# Altium schematic sheet LPDDR4 SDRAM - 2.SchDoc: RK3399 SOM Module
size A3; Date: 23.05.2023; Author: Łukasz Nowarkiewicz; SheetNumber: 2; SheetTotal: 21; RegistrationBookNumber: 144201; title_sheet: LPDDR4 SDRAM - 2
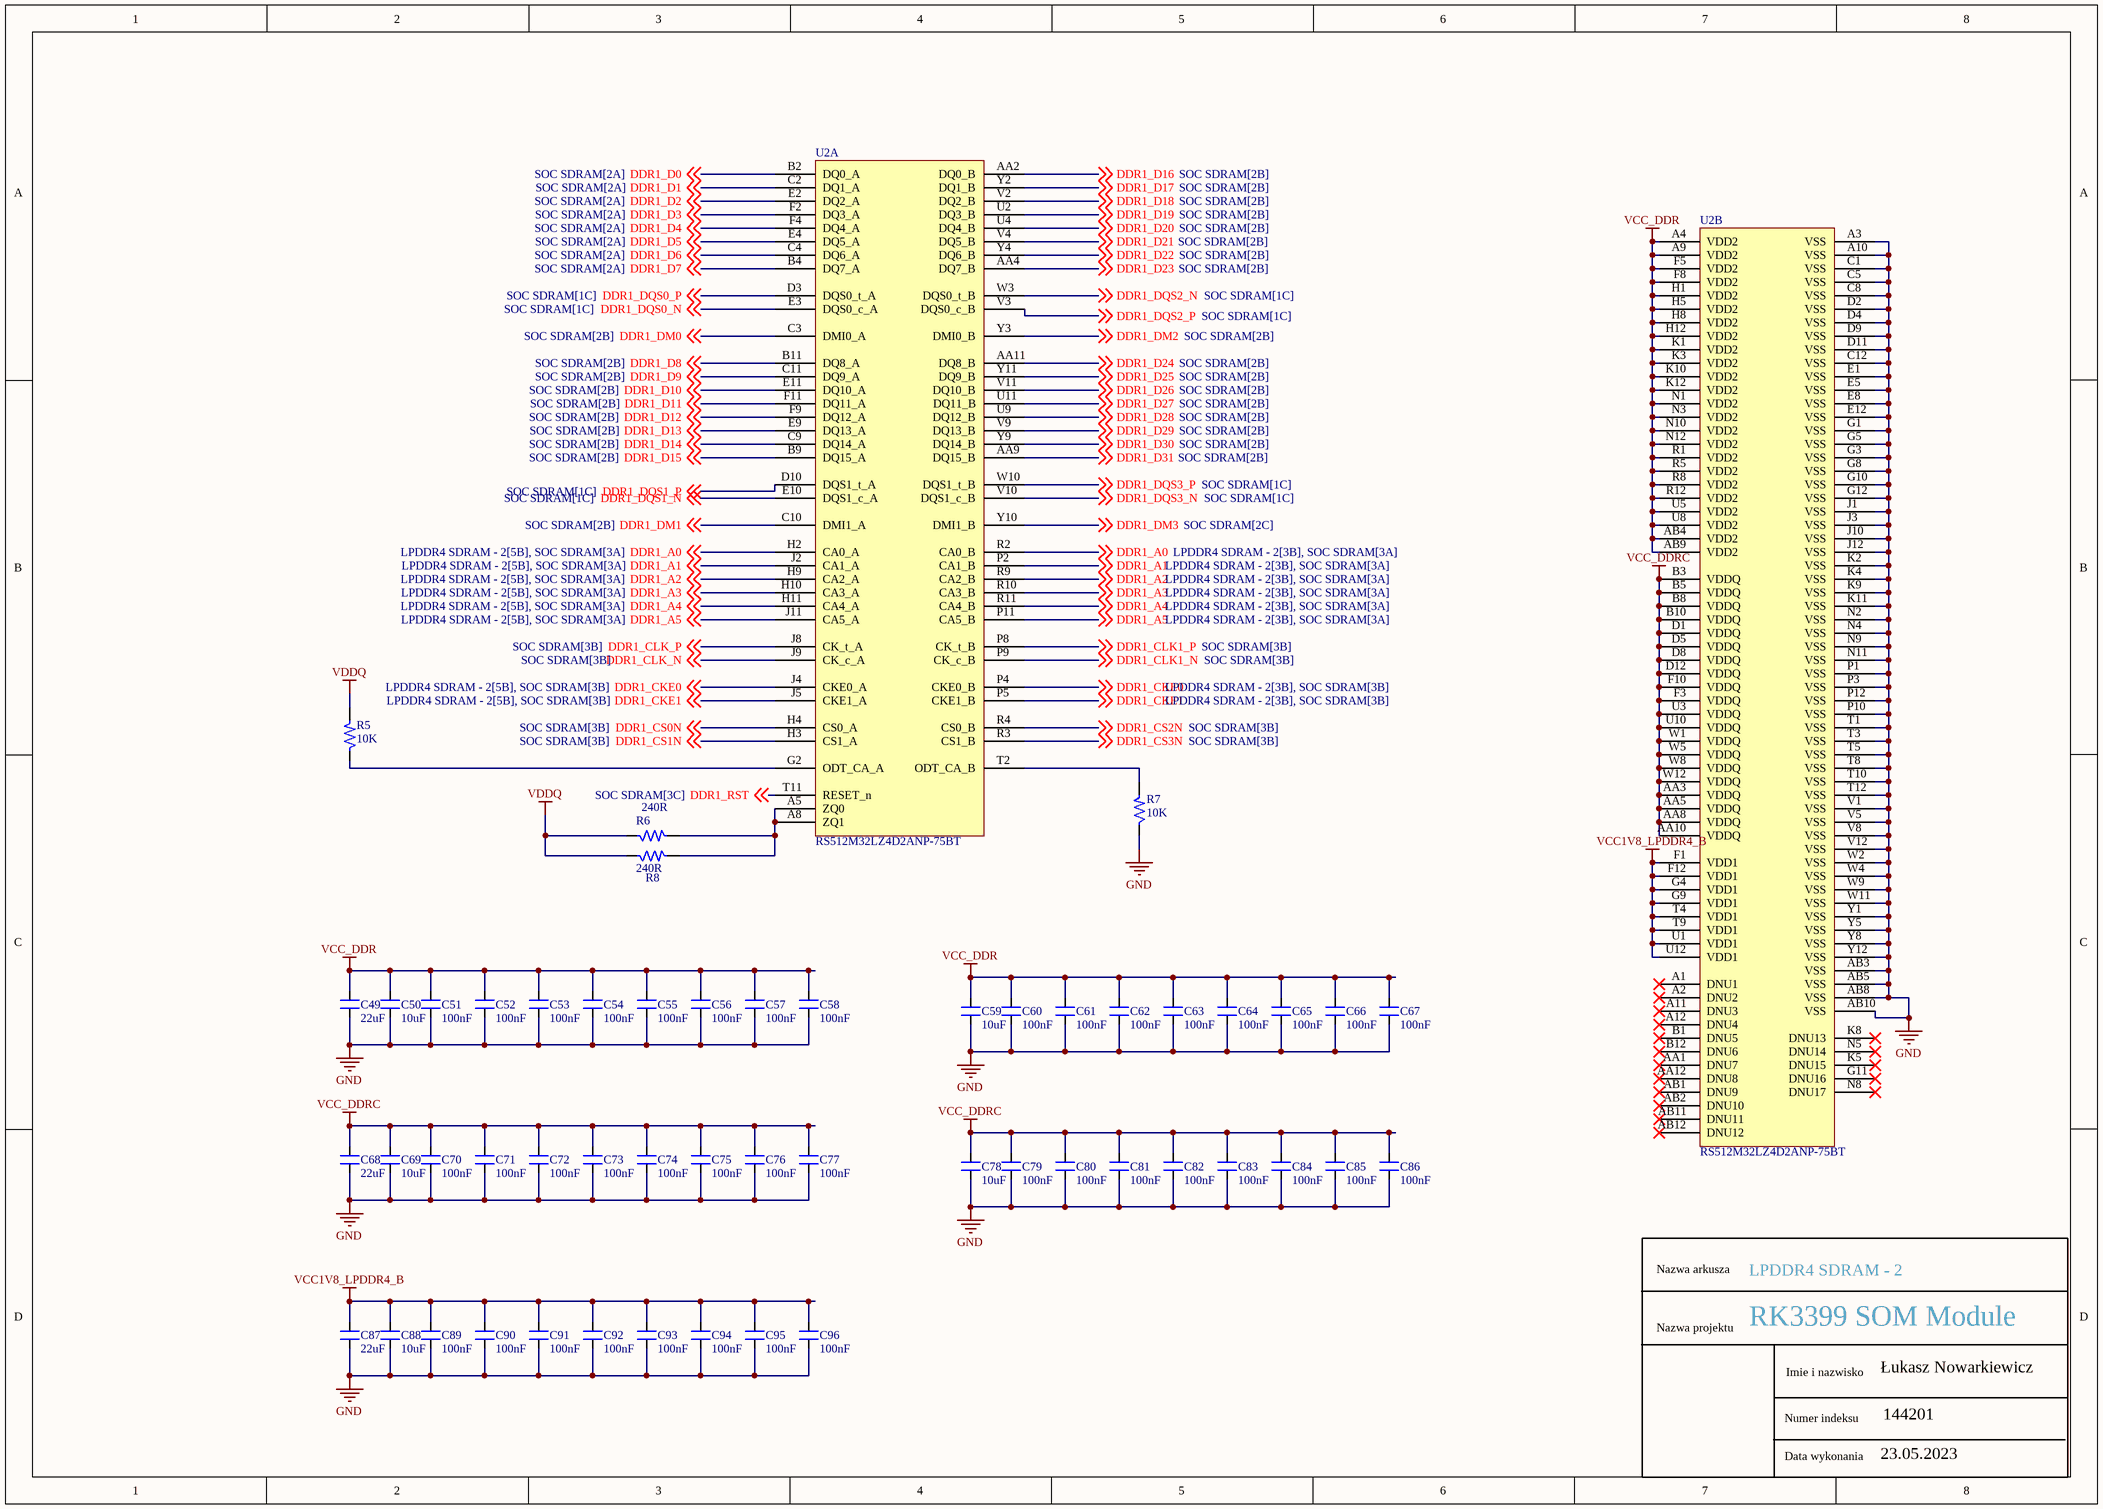
[diagram p0: LPDDR4 SDRAM - 2.SchDoc]

## Parts
C49  22uF  [CAP_0603]
C50  10uF  [CAP_0603]
C51  100nF  [CAP_0402]
C52  100nF  [CAP_0402]
C53  100nF  [CAP_0402]
C54  100nF  [CAP_0402]
C55  100nF  [CAP_0402]
C56  100nF  [CAP_0402]
C57  100nF  [CAP_0402]
C58  100nF  [CAP_0402]
C59  10uF  [CAP_0603]
C60  100nF  [CAP_0402]
C61  100nF  [CAP_0402]
C62  100nF  [CAP_0402]
C63  100nF  [CAP_0402]
C64  100nF  [CAP_0402]
C65  100nF  [CAP_0402]
C66  100nF  [CAP_0402]
C67  100nF  [CAP_0402]
C68  22uF  [CAP_0603]
C69  10uF  [CAP_0603]
C70  100nF  [CAP_0402]
C71  100nF  [CAP_0402]
C72  100nF  [CAP_0402]
C73  100nF  [CAP_0402]
C74  100nF  [CAP_0402]
C75  100nF  [CAP_0402]
C76  100nF  [CAP_0402]
C77  100nF  [CAP_0402]
C78  10uF  [CAP_0603]
C79  100nF  [CAP_0402]
C80  100nF  [CAP_0402]
C81  100nF  [CAP_0402]
C82  100nF  [CAP_0402]
C83  100nF  [CAP_0402]
C84  100nF  [CAP_0402]
C85  100nF  [CAP_0402]
C86  100nF  [CAP_0402]
C87  22uF  [CAP_0603]
C88  10uF  [CAP_0603]
C89  100nF  [CAP_0402]
C90  100nF  [CAP_0402]
C91  100nF  [CAP_0402]
C92  100nF  [CAP_0402]
C93  100nF  [CAP_0402]
C94  100nF  [CAP_0402]
C95  100nF  [CAP_0402]
C96  100nF  [CAP_0402]
R5  10K  [RES_0201]
R6  240R  [RES_0201]
R7  10K  [RES_0201]
R8  240R  [RES_0201]
U2  RS512M32LZ4D2ANP-75BT  [FBGA200_SMD]  (parts A,B of 2)

## Nets
GND: C49.1 C50.1 C51.1 C52.1 C53.1 C54.1 C55.1 C56.1 C57.1 C58.1 C59.1 C60.1 C61.1 C62.1 C63.1 C64.1 C65.1 C66.1 C67.1 C68.1 C69.1 C70.1 C71.1 C72.1 C73.1 C74.1 C75.1 C76.1 C77.1 C78.1 C79.1 C80.1 C81.1 C82.1 C83.1 C84.1 C85.1 C86.1 C87.1 C88.1 C89.1 C90.1 C91.1 C92.1 C93.1 C94.1 C95.1 C96.1 R7.1 U2.A3(VSS) U2.A10(VSS) U2.AB3(VSS) U2.AB5(VSS) U2.AB8(VSS) U2.AB10(VSS) U2.C1(VSS) U2.C5(VSS) U2.C8(VSS) U2.C12(VSS) U2.D2(VSS) U2.D4(VSS) U2.D9(VSS) U2.D11(VSS) U2.E1(VSS) U2.E5(VSS) U2.E8(VSS) U2.E12(VSS) U2.G1(VSS) U2.G3(VSS) U2.G5(VSS) U2.G8(VSS) U2.G10(VSS) U2.G12(VSS) U2.J1(VSS) U2.J3(VSS) U2.J10(VSS) U2.J12(VSS) U2.K2(VSS) U2.K4(VSS) U2.K9(VSS) U2.K11(VSS) U2.N2(VSS) U2.N4(VSS) U2.N9(VSS) U2.N11(VSS) U2.P1(VSS) U2.P3(VSS) U2.P10(VSS) U2.P12(VSS) U2.T1(VSS) U2.T3(VSS) U2.T5(VSS) U2.T8(VSS) U2.T10(VSS) U2.T12(VSS) U2.V1(VSS) U2.V5(VSS) U2.V8(VSS) U2.V12(VSS) U2.W2(VSS) U2.W4(VSS) U2.W9(VSS) U2.W11(VSS) U2.Y1(VSS) U2.Y5(VSS) U2.Y8(VSS) U2.Y12(VSS)
VCC1V8_LPDDR4_B: C87.2 C88.2 C89.2 C90.2 C91.2 C92.2 C93.2 C94.2 C95.2 C96.2 U2.F1(VDD1) U2.F12(VDD1) U2.G4(VDD1) U2.G9(VDD1) U2.T4(VDD1) U2.T9(VDD1) U2.U1(VDD1) U2.U12(VDD1)
VCC_DDR: C49.2 C50.2 C51.2 C52.2 C53.2 C54.2 C55.2 C56.2 C57.2 C58.2 C59.2 C60.2 C61.2 C62.2 C63.2 C64.2 C65.2 C66.2 C67.2 U2.A4(VDD2) U2.A9(VDD2) U2.AB4(VDD2) U2.AB9(VDD2) U2.F5(VDD2) U2.F8(VDD2) U2.H1(VDD2) U2.H5(VDD2) U2.H8(VDD2) U2.H12(VDD2) U2.K1(VDD2) U2.K3(VDD2) U2.K10(VDD2) U2.K12(VDD2) U2.N1(VDD2) U2.N3(VDD2) U2.N10(VDD2) U2.N12(VDD2) U2.R1(VDD2) U2.R5(VDD2) U2.R8(VDD2) U2.R12(VDD2) U2.U5(VDD2) U2.U8(VDD2)
VCC_DDRC: C68.2 C69.2 C70.2 C71.2 C72.2 C73.2 C74.2 C75.2 C76.2 C77.2 C78.2 C79.2 C80.2 C81.2 C82.2 C83.2 C84.2 C85.2 C86.2 U2.AA3(VDDQ) U2.AA5(VDDQ) U2.AA8(VDDQ) U2.AA10(VDDQ) U2.B3(VDDQ) U2.B5(VDDQ) U2.B8(VDDQ) U2.B10(VDDQ) U2.D1(VDDQ) U2.D5(VDDQ) U2.D8(VDDQ) U2.D12(VDDQ) U2.F3(VDDQ) U2.F10(VDDQ) U2.U3(VDDQ) U2.U10(VDDQ) U2.W1(VDDQ) U2.W5(VDDQ) U2.W8(VDDQ) U2.W12(VDDQ)
VDDQ: R5.2 R6.1 R8.1
DDR1_A0: U2.H2(CA0_A) U2.R2(CA0_B) ; off-sheet DDR1_A0
DDR1_A1: U2.J2(CA1_A) U2.P2(CA1_B) ; off-sheet DDR1_A1
DDR1_A2: U2.H9(CA2_A) U2.R9(CA2_B) ; off-sheet DDR1_A2
DDR1_A3: U2.H10(CA3_A) U2.R10(CA3_B) ; off-sheet DDR1_A3
DDR1_A4: U2.H11(CA4_A) U2.R11(CA4_B) ; off-sheet DDR1_A4
DDR1_A5: U2.J11(CA5_A) U2.P11(CA5_B) ; off-sheet DDR1_A5
DDR1_CKE0: U2.J4(CKE0_A) U2.P4(CKE0_B) ; off-sheet DDR1_CKE0
DDR1_CKE1: U2.J5(CKE1_A) U2.P5(CKE1_B) ; off-sheet DDR1_CKE1
DDR1_CLK1_N: U2.P9(CK_c_B) ; off-sheet DDR1_CLK1_N
DDR1_CLK1_P: U2.P8(CK_t_B) ; off-sheet DDR1_CLK1_P
DDR1_CLK_N: U2.J9(CK_c_A) ; off-sheet DDR1_CLK_N
DDR1_CLK_P: U2.J8(CK_t_A) ; off-sheet DDR1_CLK_P
DDR1_CS0N: U2.H4(CS0_A) ; off-sheet DDR1_CS0N
DDR1_CS1N: U2.H3(CS1_A) ; off-sheet DDR1_CS1N
DDR1_CS2N: U2.R4(CS0_B) ; off-sheet DDR1_CS2N
DDR1_CS3N: U2.R3(CS1_B) ; off-sheet DDR1_CS3N
DDR1_D0: U2.B2(DQ0_A) ; off-sheet DDR1_D0
DDR1_D1: U2.C2(DQ1_A) ; off-sheet DDR1_D1
DDR1_D2: U2.E2(DQ2_A) ; off-sheet DDR1_D2
DDR1_D3: U2.F2(DQ3_A) ; off-sheet DDR1_D3
DDR1_D4: U2.F4(DQ4_A) ; off-sheet DDR1_D4
DDR1_D5: U2.E4(DQ5_A) ; off-sheet DDR1_D5
DDR1_D6: U2.C4(DQ6_A) ; off-sheet DDR1_D6
DDR1_D7: U2.B4(DQ7_A) ; off-sheet DDR1_D7
DDR1_D8: U2.B11(DQ8_A) ; off-sheet DDR1_D8
DDR1_D9: U2.C11(DQ9_A) ; off-sheet DDR1_D9
DDR1_D10: U2.E11(DQ10_A) ; off-sheet DDR1_D10
DDR1_D11: U2.F11(DQ11_A) ; off-sheet DDR1_D11
DDR1_D12: U2.F9(DQ12_A) ; off-sheet DDR1_D12
DDR1_D13: U2.E9(DQ13_A) ; off-sheet DDR1_D13
DDR1_D14: U2.C9(DQ14_A) ; off-sheet DDR1_D14
DDR1_D15: U2.B9(DQ15_A) ; off-sheet DDR1_D15
DDR1_D16: U2.AA2(DQ0_B) ; off-sheet DDR1_D16
DDR1_D17: U2.Y2(DQ1_B) ; off-sheet DDR1_D17
DDR1_D18: U2.V2(DQ2_B) ; off-sheet DDR1_D18
DDR1_D19: U2.U2(DQ3_B) ; off-sheet DDR1_D19
DDR1_D20: U2.U4(DQ4_B) ; off-sheet DDR1_D20
DDR1_D21: U2.V4(DQ5_B) ; off-sheet DDR1_D21
DDR1_D22: U2.Y4(DQ6_B) ; off-sheet DDR1_D22
DDR1_D23: U2.AA4(DQ7_B) ; off-sheet DDR1_D23
DDR1_D24: U2.AA11(DQ8_B) ; off-sheet DDR1_D24
DDR1_D25: U2.Y11(DQ9_B) ; off-sheet DDR1_D25
DDR1_D26: U2.V11(DQ10_B) ; off-sheet DDR1_D26
DDR1_D27: U2.U11(DQ11_B) ; off-sheet DDR1_D27
DDR1_D28: U2.U9(DQ12_B) ; off-sheet DDR1_D28
DDR1_D29: U2.V9(DQ13_B) ; off-sheet DDR1_D29
DDR1_D30: U2.Y9(DQ14_B) ; off-sheet DDR1_D30
DDR1_D31: U2.AA9(DQ15_B) ; off-sheet DDR1_D31
DDR1_DM0: U2.C3(DMI0_A) ; off-sheet DDR1_DM0
DDR1_DM1: U2.C10(DMI1_A) ; off-sheet DDR1_DM1
DDR1_DM2: U2.Y3(DMI0_B) ; off-sheet DDR1_DM2
DDR1_DM3: U2.Y10(DMI1_B) ; off-sheet DDR1_DM3
DDR1_DQS0_N: U2.E3(DQS0_c_A) ; off-sheet DDR1_DQS0_N
DDR1_DQS0_P: U2.D3(DQS0_t_A) ; off-sheet DDR1_DQS0_P
DDR1_DQS1_N: U2.E10(DQS1_c_A) ; off-sheet DDR1_DQS1_N
DDR1_DQS1_P: U2.D10(DQS1_t_A) ; off-sheet DDR1_DQS1_P
DDR1_DQS2_N: U2.W3(DQS0_t_B) ; off-sheet DDR1_DQS2_N
DDR1_DQS2_P: U2.V3(DQS0_c_B) ; off-sheet DDR1_DQS2_P
DDR1_DQS3_N: U2.V10(DQS1_c_B) ; off-sheet DDR1_DQS3_N
DDR1_DQS3_P: U2.W10(DQS1_t_B) ; off-sheet DDR1_DQS3_P
DDR1_RST: U2.T11(RESET_n) ; off-sheet DDR1_RST
NetR5_1: R5.1 U2.G2(ODT_CA_A)
NetR6_2: R6.2 R8.2 U2.A5(ZQ0) U2.A8(ZQ1)
NetR7_2: R7.2 U2.T2(ODT_CA_B)

Not connected (* = marked no-connect by the designer): U2 A1(DNU1)* A2(DNU2)* A11(DNU3)* A12(DNU4)* AA1(DNU7)* AA12(DNU8)* AB1(DNU9)* AB2(DNU10)* AB11(DNU11)* AB12(DNU12)* B1(DNU5)* B12(DNU6)* G11(DNU16)* K5(DNU15)* K8(DNU13)* N5(DNU14)* N8(DNU17)*

## Notes on the sheet
- Nazwa arkusza
- Nazwa projektu
- Imie i nazwisko
- Data wykonania
- Numer indeksu

## Library data of the parts
C49 C68 C87 = CAP_22uF-10V-20%-0603: 22µF ±20% 10V Ceramic Capacitor X5R 0603 (1608 Metric); Manufacturer: Murata Electronics; Manufacturer Part Number: GRM188R61A226ME15D; Case/Package: 0603; Supplier-1: Digikey
C50 C59 C69 C78 C88 = CAP_10uF-10V-10%-0603: 10µF ±10% 10V Ceramic Capacitor X5R 0603 (1608 Metric); Manufacturer Part Number: GRM188R61A106KE69J; Manufacturer: Murata Electronics; Case/Package: 0603; Supplier-1: Digikey
C51-C58 C60-C67 C70-C77 C79-C86 C89-C96 = CAP_100nF-10V-10%-0402: 0.1µF ±10% 10V Ceramic Capacitor X7R 0402 (1005 Metric); Manufacturer: Yageo; Manufacturer Part Number: CC0402KRX7R6BB104; Case/Package: 0402; Supplier-1: Digikey
R5 R7 = RES_10K-0.05W-1%-0201: 10 kOhms ±1% 0.05W, 1/20W Chip Resistor 0201 (0603 Metric) Thick Film; Manufacturer: Stackpole Electronics Inc; Manufacturer Part Number: RMCF0201FT10K0; Case/Package: 0201; Supplier-1: Digikey
R6 R8 = RES_240R-0.05W-1%-0201: 240 Ohms ±1% 0.05W, 1/20W Chip Resistor 0201 (0603 Metric) Thick Film; Manufacturer: Yageo; Manufacturer Part Number: RC0201FR-07240RL; Case/Package: 0201; Supplier-1: Digikey
U2 = IC_RS512M32LZ4D2ANP-75BT: LPDDR4/4X Package FBGA 200b Density 4Gbit~64Gbit Operating Temperature Range：-25~85℃ Speed：2667Mbps/3200Mbps/3733Mbps Voltage：VDD1/VDD2/VDDQ= 1.8 / 1.1 / 1.1 V（LPDDR4）VDD1/VDD2/VDDQ = 1.8 / 1.1 / 0.6 V（LPDDR4X）Approved Verification Platform：MTK、Spreadtrum; Manufacturer: RAYSON; Manufacturer Part Number: RS512M32LZ4D2ANP-75BT; Case/Package: FBGA 200b; Supplier-1: RAYSON